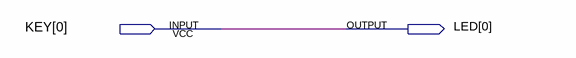
[diagram p0: schematic sheet]
// Quartus schematic sample-00.bdf as structural Verilog: 0 symbols, 2 pins
module \sample-00  (
  input  [0:0] KEY,
  output [0:0] LED
);


  assign LED[0] = KEY[0];
endmodule
